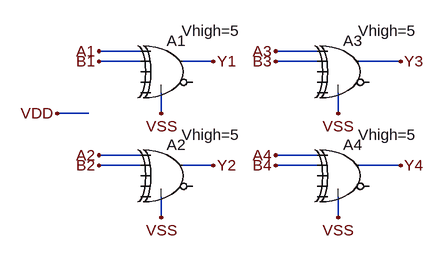
[diagram p0: schematic 74hc86.asc]
74hc86.asc, the LTspice schematic file:
Version 4
SHEET 1 1612 680
WIRE 256 0 192 0
WIRE 528 0 464 0
WIRE 256 16 192 16
WIRE 368 16 320 16
WIRE 528 16 464 16
WIRE 656 16 592 16
WIRE 176 96 128 96
WIRE 288 96 288 64
WIRE 560 96 560 64
WIRE 256 160 192 160
WIRE 528 160 464 160
WIRE 256 176 192 176
WIRE 368 176 320 176
WIRE 528 176 464 176
WIRE 656 176 592 176
WIRE 288 256 288 224
WIRE 560 256 560 224
FLAG 368 16 Y1
FLAG 368 176 Y2
FLAG 656 16 Y3
FLAG 656 176 Y4
FLAG 192 0 A1
FLAG 192 160 A2
FLAG 464 0 A3
FLAG 464 160 A4
FLAG 192 16 B1
FLAG 192 176 B2
FLAG 464 16 B3
FLAG 464 176 B4
FLAG 288 96 VSS
FLAG 560 96 VSS
FLAG 560 256 VSS
FLAG 288 256 VSS
FLAG 128 96 VDD
SYMBOL Digital\\xor 304 -32 R0
WINDOW 3 15 1 Left 2
SYMATTR InstName A1
SYMATTR Value Vhigh=5
SYMBOL Digital\\xor 304 128 R0
WINDOW 3 15 1 Left 2
SYMATTR InstName A2
SYMATTR Value Vhigh=5
SYMBOL Digital\\xor 576 -32 R0
WINDOW 3 15 1 Left 2
SYMATTR InstName A3
SYMATTR Value Vhigh=5
SYMBOL Digital\\xor 576 128 R0
WINDOW 3 15 1 Left 2
SYMATTR InstName A4
SYMATTR Value Vhigh=5

The netlist it stands for:
* 74hc86.asc
A1 A1 B1 VSS VSS VSS VSS Y1 VSS XOR Vhigh=5
A2 A2 B2 VSS VSS VSS VSS Y2 VSS XOR Vhigh=5
A3 A3 B3 VSS VSS VSS VSS Y3 VSS XOR Vhigh=5
A4 A4 B4 VSS VSS VSS VSS Y4 VSS XOR Vhigh=5
.backanno
.end